# EAGLE design Tesseract_DC_Geared_Routed (EAGLE 7.7.0)

## Sheet 1 of 2

## Sheet 2 of 2
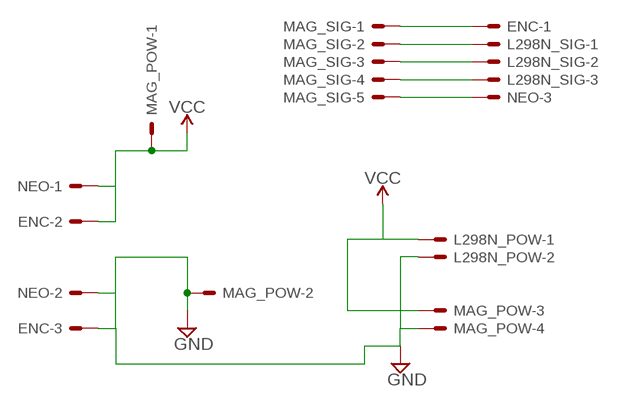
[diagram p0: schematic, sheet 2]

### Parts
ENC  JST-XH-03-PIN-LONG-PAD  [JST-XH-03-PACKAGE-LONG-PAD]
L298N_POW  JST-XH-02-PIN-LONG-PAD  [JST-XH-02-PACKAGE-LONG-PAD]
L298N_SIG  JST-XH-03-PIN-LONG-PAD  [JST-XH-03-PACKAGE-LONG-PAD]
MAG_POW  JST-XH-04-PIN-LONG-PAD  [JST-XH-04-PACKAGE-LONG-PAD]
MAG_SIG  JST-XH-05-PIN-LONG-PAD  [JST-XH-05-PACKAGE-LONG-PAD]
NEO  JST-XH-03-PIN-LONG-PAD  [JST-XH-03-PACKAGE-LONG-PAD]

### Nets
5V_GND: ENC.3 L298N_POW.2 MAG_POW.2 MAG_POW.4 NEO.2 ; supply symbol labelled GND
5V_VCC: ENC.2 MAG_POW.1 NEO.1 ; supply symbol labelled VCC
12V_VCC: L298N_POW.1 MAG_POW.3 ; supply symbol labelled VCC
PIN3: ENC.1 MAG_SIG.1
PIN4: L298N_SIG.1 MAG_SIG.2
PIN5: L298N_SIG.2 MAG_SIG.3
PIN6: L298N_SIG.3 MAG_SIG.4
PIN7: MAG_SIG.5 NEO.3

## Library data of the parts
ENC L298N_SIG NEO = Rembrandt Electronics - JST XH Connectors v1-0:JST-XH-03-PIN: JST XH Connector 2 Pin Wire to board connector. Pitch: 2,54 mm, (0.100") Number of pins: 3 Created by Rembrandt Electronics www.rembrandtelectronics.com
L298N_POW = Rembrandt Electronics - JST XH Connectors v1-0:JST-XH-02-PIN: JST XH Connector 2 Pin Wire to board connector. Pitch: 2,54 mm, (0.100") Number of pins: 2 Created by Rembrandt Electronics www.rembrandtelectronics.com
MAG_POW = Rembrandt Electronics - JST XH Connectors v1-0:JST-XH-04-PIN: JST XH Connector 2 Pin Wire to board connector. Pitch: 2,54 mm, (0.100") Number of pins: 4 Created by Rembrandt Electronics www.rembrandtelectronics.com
MAG_SIG = Rembrandt Electronics - JST XH Connectors v1-0:JST-XH-05-PIN: JST XH Connector 2 Pin Wire to board connector. Pitch: 2,54 mm, (0.100") Number of pins: 5 Created by Rembrandt Electronics www.rembrandtelectronics.com

## Board
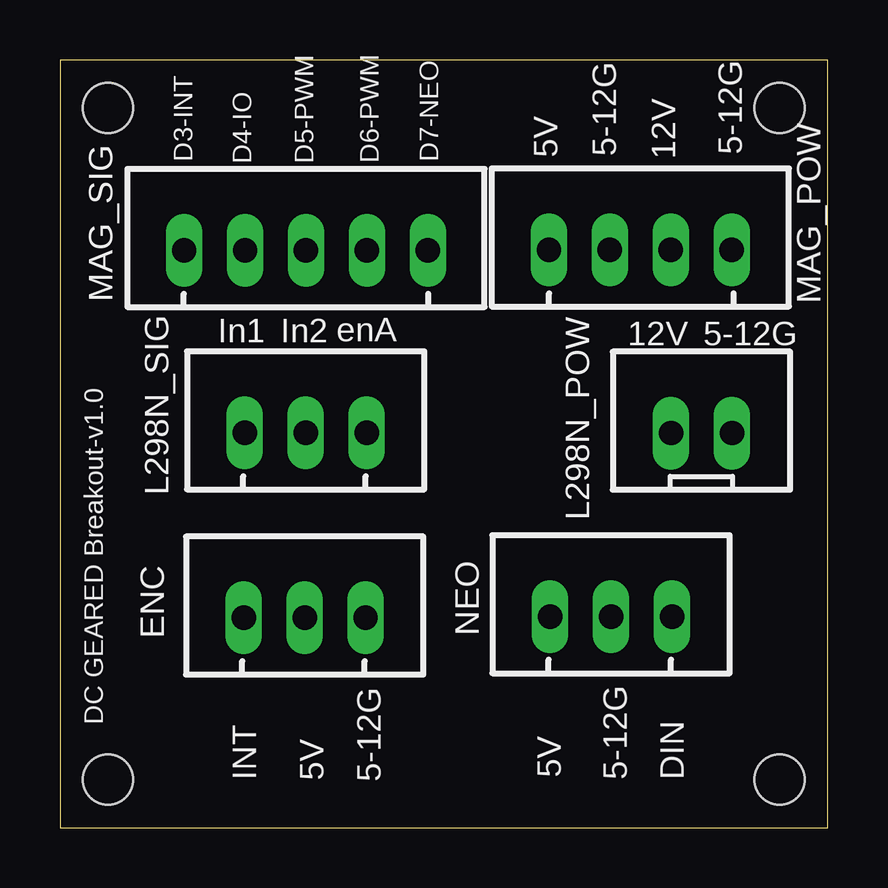
[diagram p1: board, top side]
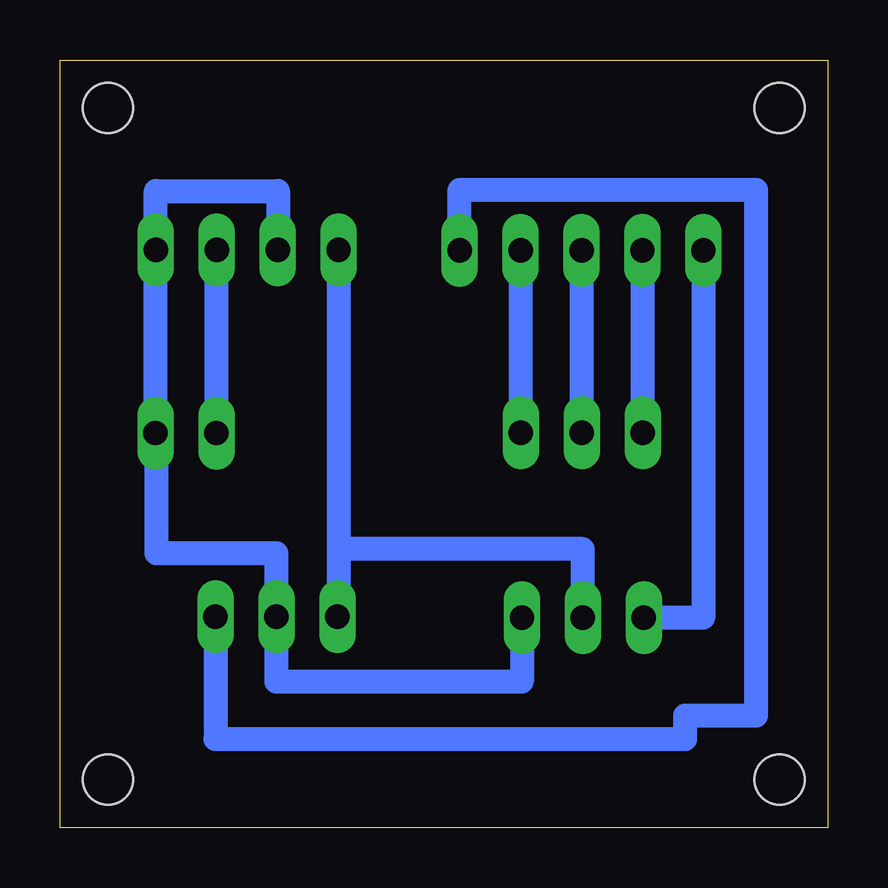
[diagram p2: board, bottom side, seen from below]

Size 32 x 32 mm. Coordinates in mm from the lower left corner, seen from the top.
Outline: 0,0 32,0 32,32 0,32 0,0
Copper layers (1*16): Top 0.035mm / dielectric 1.5mm / Bottom 0.035mm
Design rules "default": minimum track width 10mil, minimum drill 24mil, track to track 8mil, track to pad 8mil, pad to pad 8mil, via to via 8mil, smd to smd 8mil, copper to edge 40mil, drill to drill 8mil, minimum pad ring 10mil, minimum via ring 8mil, stop-mask expansion 4mil, vias tented up to drill 0mil, thermal gap 10mil
Holes 2.1 mm at 30,2 2,2 30,30 2,30

### Footprints (pad centres in the part's own frame; a part is rotated, then mirrored left to right if it is on the bottom)
JST-XH-03-PACKAGE-LONG-PAD = drill 1.016 long: 1 -2.54,0; 2 0,0; 3 2.54,0
JST-XH-02-PACKAGE-LONG-PAD = drill 1.016 long: 1 -1.27,0; 2 1.27,0
JST-XH-04-PACKAGE-LONG-PAD = drill 1.016 long: 1 -3.81,0; 2 -1.27,0; 3 1.27,0; 4 3.81,0
JST-XH-05-PACKAGE-LONG-PAD = drill 1.016 long: 1 -5.08,0; 2 -2.54,0; 3 0,0; 4 2.54,0; 5 5.08,0

### Placement (x,y rotation side)
ENC  10.2,8.74 0 top
L298N_POW  26.75,16.45 0 top
L298N_SIG  10.24,16.45 0 top
MAG_POW  24.19,24.08 0 top
MAG_SIG  10.26,24.06 0 top
NEO  22.97,8.79 0 top
U$15  [12X12]  16,30 0 top

### Tracks (layer width: path | path; a pad name or v marks a point on that pad's centre or on a via)
5V_GND
  Bottom 0.406: NEO.2 | 27.98,16.45 L298N_POW.2 | 28.02,24.08 MAG_POW.4 | 22.91,24.08 MAG_POW.2
  Bottom 1: ENC.3 12.74,6.08 22.97,6.08 NEO.2 | NEO.2 22.97,11.44 27.98,11.44 27.98,16.45 | L298N_POW.2 28.02,24.08 | MAG_POW.4 28,26.54 22.91,26.54 22.91,24.08
5V_VCC
  Bottom 0.406: 20.38,8.79 NEO.1
  Bottom 1: MAG_POW.1 20.38,11.61 | 20.38,11.61 20.38,8.79 | ENC.2 10.2,11.61 20.38,11.61
12V_VCC
  Bottom 0.406: 25.48,24.08 MAG_POW.3
  Bottom 1: L298N_POW.1 25.48,24.08
PIN3
  Bottom 1: MAG_SIG.1 5.18,8.74 ENC.1
PIN4
  Bottom 0.406: 7.72,16.45 L298N_SIG.1
  Bottom 1: MAG_SIG.2 7.72,16.45
PIN5
  Bottom 0.406: 10.26,16.45 L298N_SIG.2
  Bottom 1: MAG_SIG.3 10.26,16.45
PIN6
  Bottom 0.406: 12.8,16.45 L298N_SIG.3
  Bottom 1: MAG_SIG.4 12.8,16.45
PIN7
  Bottom 1: NEO.3 25.51,3.69 5.94,3.69 5.94,4.67 2.98,4.67 2.98,26.59 15.34,26.59 MAG_SIG.5

### Text on the board
tNames: D3-INT | D4-IO | D5-PWM | D6-PWM | D7-NEO | 5V | 5-12G | 12V | 5-12G | In1 | In2 | enA | 12V | 5-12G | DC GEARED Breakout-v1.0 | INT | 5V | 5-12G | 5V | 5-12G | DIN